# EAGLE design CurrentProbe (EAGLE 9.6.2)
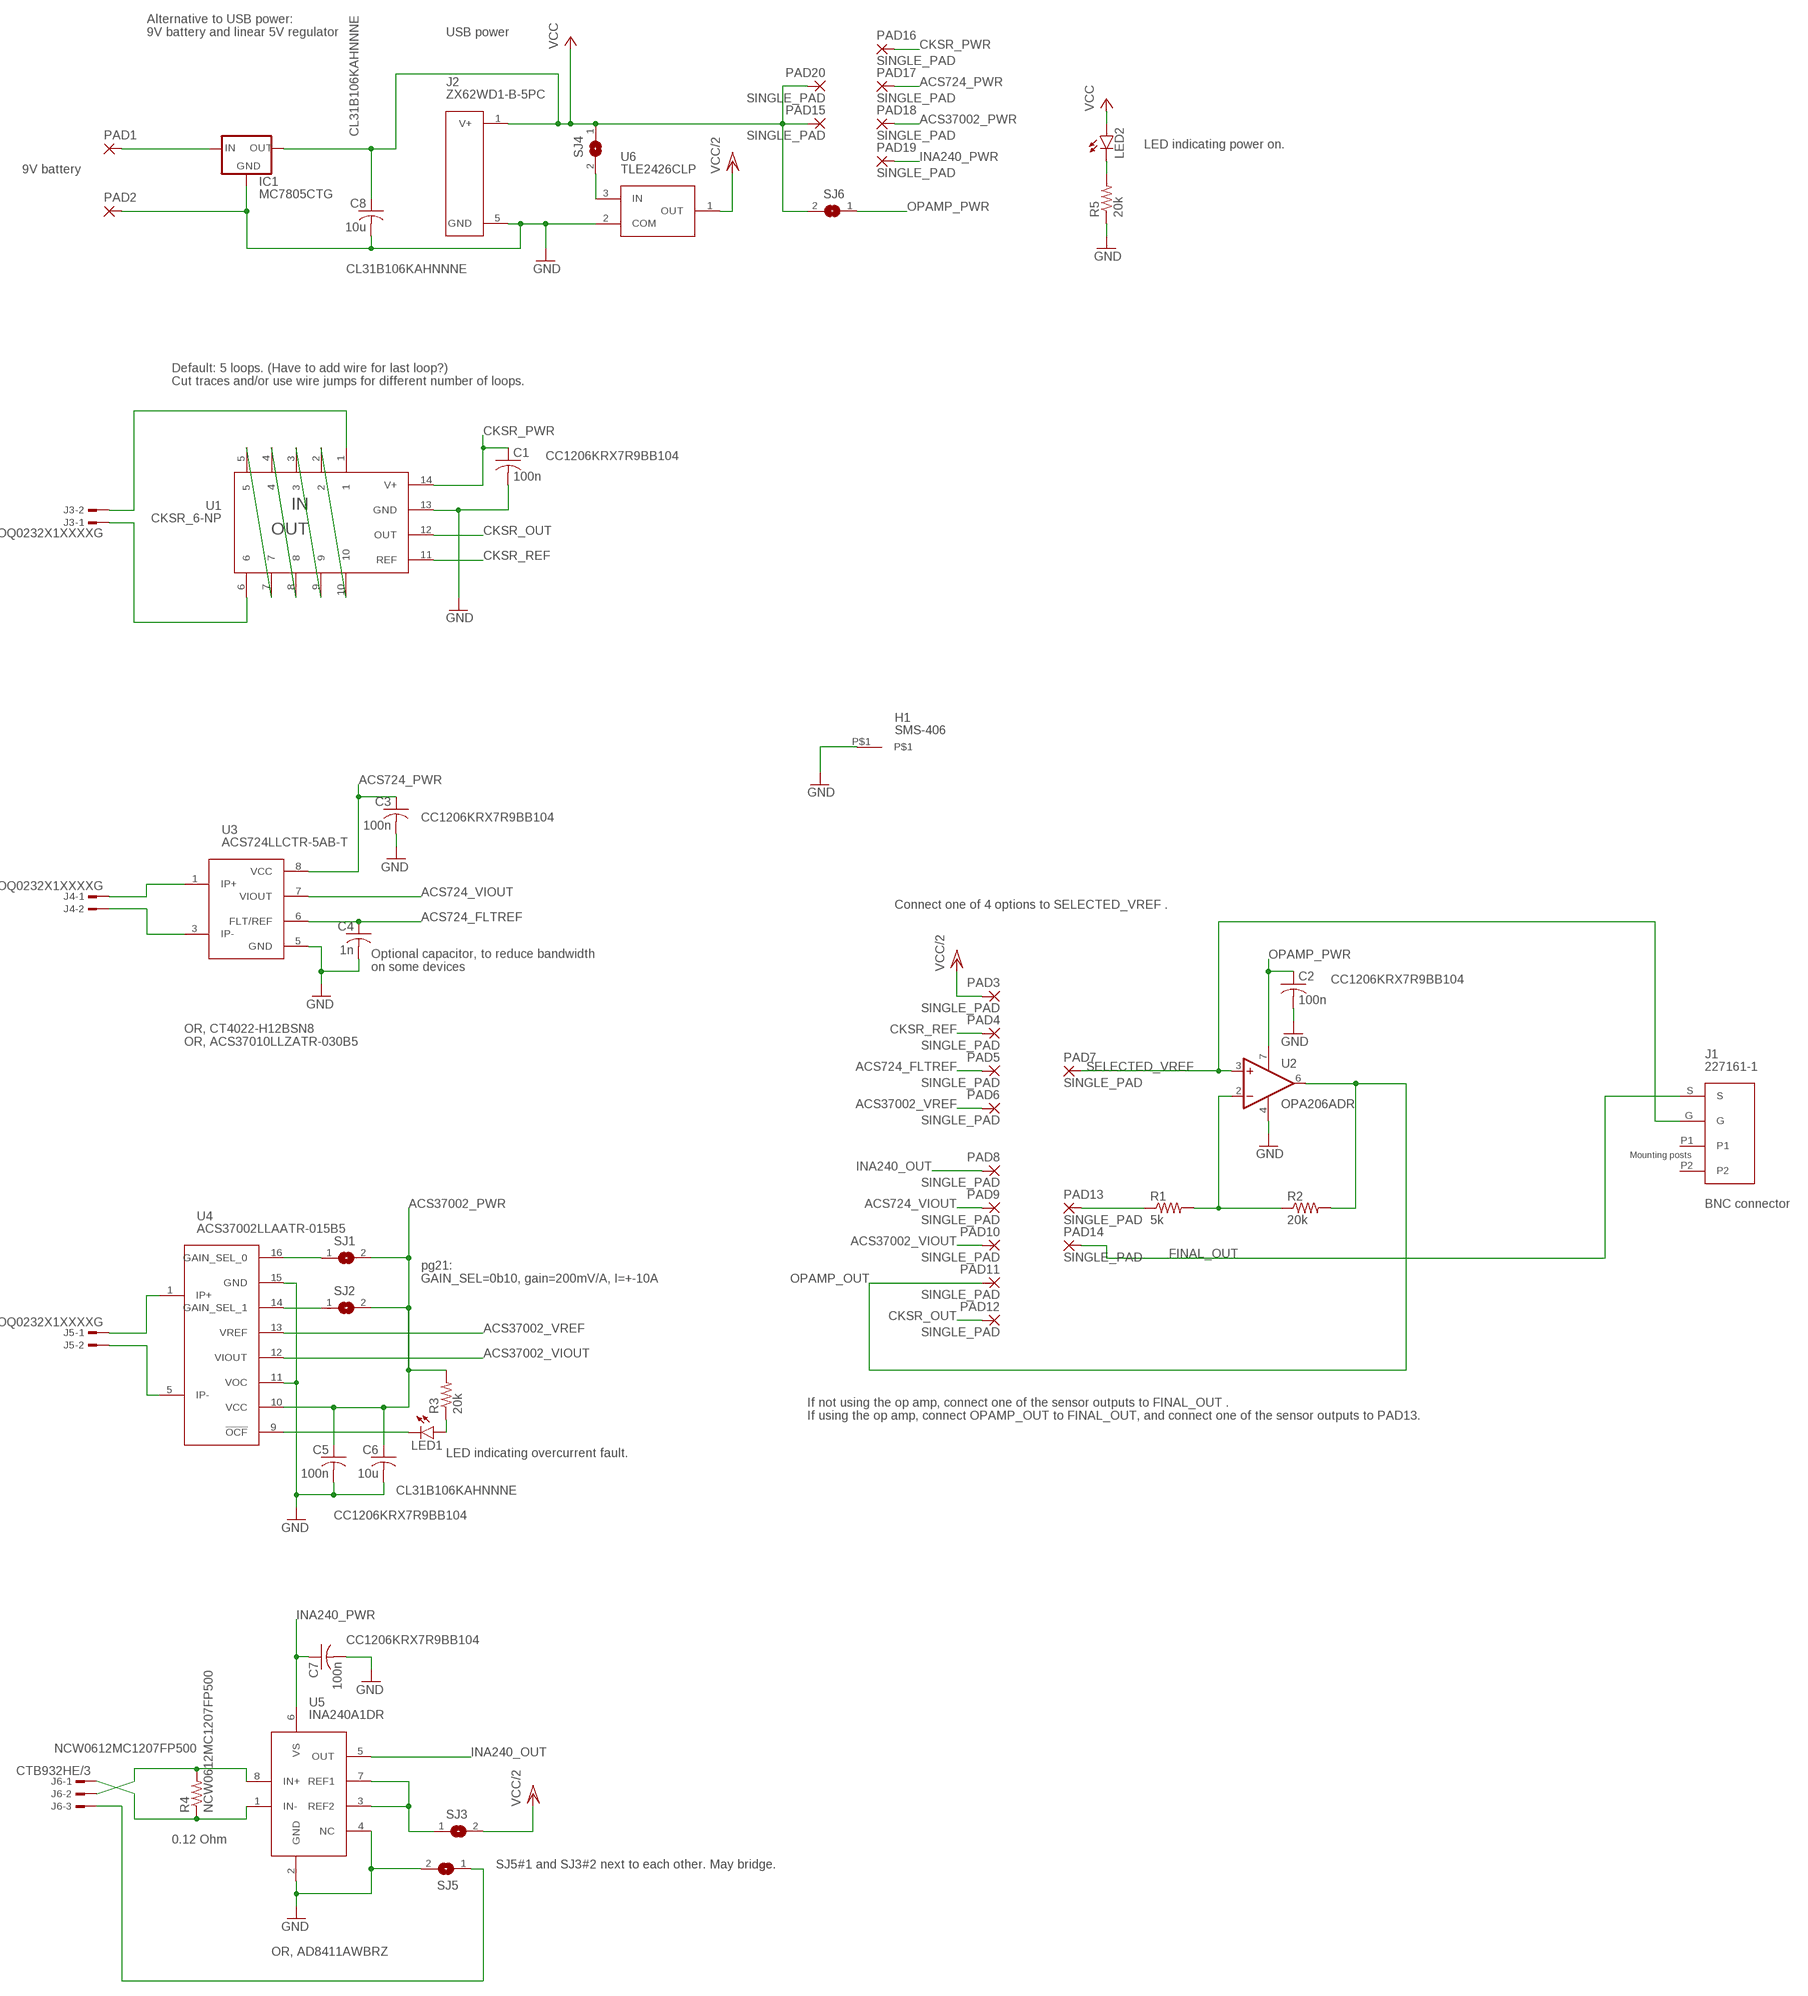
[diagram p0: schematic, sheet 1]

## Parts
C1  100n  C-USC1206K  [C1206K]
C2  100n  C-USC1206K  [C1206K]
C3  100n  C-USC1206K  [C1206K]
C4  1n  C-USC1206K  [C1206K]
C5  100n  C-USC1206K  [C1206K]
C6  10u  C-USC1206K  [C1206K]
C7  100n  C-USC1206K  [C1206K]
C8  10u  C-USC1206K  [C1206K]
H1  SMS-406  [SMS-406]
IC1  MC7805CTG  78XXS  [78XXS]
J1  227161-1  [227161-1]
J2  ZX62WD1-B-5PC  [ZX62WD1-B-5PC]
J3  OQ0232X1XXXXG  [OQ0232X1XXXXG]
J4  OQ0232X1XXXXG  [OQ0232X1XXXXG]
J5  OQ0232X1XXXXG  [OQ0232X1XXXXG]
J6  CTB932HE/3  [CTB932HE/3]
LED1  LEDSQR2X5  [LED2X5]
LED2  LEDSQR2X5  [LED2X5]
PAD1  2,54/1,0  [2,54/1,0]
PAD2  2,54/1,0  [2,54/1,0]
PAD3  SINGLE_PAD  [CIRCLE_PAD]
PAD4  SINGLE_PAD  [CIRCLE_PAD]
PAD5  SINGLE_PAD  [CIRCLE_PAD]
PAD6  SINGLE_PAD  [CIRCLE_PAD]
PAD7  SINGLE_PAD  [CIRCLE_PAD]
PAD8  SINGLE_PAD  [CIRCLE_PAD]
PAD9  SINGLE_PAD  [CIRCLE_PAD]
PAD10  SINGLE_PAD  [CIRCLE_PAD]
PAD11  SINGLE_PAD  [CIRCLE_PAD]
PAD12  SINGLE_PAD  [CIRCLE_PAD]
PAD13  SINGLE_PAD  [CIRCLE_PAD]
PAD14  SINGLE_PAD  [CIRCLE_PAD]
PAD15  SINGLE_PAD  [CIRCLE_PAD]
PAD16  SINGLE_PAD  [CIRCLE_PAD]
PAD17  SINGLE_PAD  [CIRCLE_PAD]
PAD18  SINGLE_PAD  [CIRCLE_PAD]
PAD19  SINGLE_PAD  [CIRCLE_PAD]
PAD20  SINGLE_PAD  [CIRCLE_PAD]
R1  5k  R-US_R1206  [R1206]
R2  20k  R-US_R1206  [R1206]
R3  20k  R-US_0207/12  [0207/12]
R4  NCW0612MC1207FP500  [R0612]
R5  20k  R-US_0207/7  [0207/7]
SJ1  SJ  [SJ]
SJ2  SJ  [SJ]
SJ3  SJ  [SJ]
SJ4  SJ  [SJ]
SJ5  SJ  [SJ]
SJ6  SJ  [SJ]
U1  CKSR_6-NP  [CKSR_XX-NP]
U2  OPA206ADR  [D0008A]
U3  ACS724LLCTR-5AB-T  [ALLEGRO_SOIC8]
U4  ACS37002LLAATR-015B5  [ALLEGRO_SOIC16]
U5  INA240A1DR  [D0008A]
U6  TLE2426CLP  [LP0003A]

## Nets
ACS724_FLTREF: C4.1 PAD5.1(P) U3.6(FLT/REF)
ACS724_PWR: C3.1 PAD17.1(P) U3.8(VCC)
ACS724_VIOUT: PAD9.1(P) U3.7(VIOUT)
ACS37002_PWR: C5.1 C6.1 PAD18.1(P) R3.2 SJ1.2 SJ2.2 U4.10(VCC)
ACS37002_VIOUT: PAD10.1(P) U4.12(VIOUT)
ACS37002_VREF: PAD6.1(P) U4.13(VREF)
CKSR_OUT: PAD12.1(P) U1.12(OUT)
CKSR_PWR: C1.1 PAD16.1(P) U1.14(V+)
CKSR_REF: PAD4.1(P) U1.11(REF)
FINAL_OUT: J1.S PAD14.1(P)
GND: C1.2 C2.2 C3.2 C4.2 C5.2 C6.2 C7.2 C8.2 H1.P$1 IC1.GND J2.5(GND) PAD2.1(P) R5.1 SJ5.2 U1.13(GND) U2.4(V-) U3.5(GND) U4.11(VOC) U4.15(GND) U5.2(GND) U5.4(NC) U6.2(COM)
INA240_OUT: PAD8.1(P) U5.5(OUT)
INA240_PWR: C7.1 PAD19.1(P) U5.6(VS)
N$1: J3.2 U1.1
N$2: J3.1 U1.6
N$3: U1.2 U1.10
N$4: U1.3 U1.9
N$5: U1.4 U1.8
N$6: U1.5 U1.7
N$7: J4.1 U3.1(IP+)
N$8: IC1.IN PAD1.1(P)
N$9: PAD13.1(P) R1.1
N$10: R1.2 R2.1 U2.2(-IN)
N$11: J4.2 U3.3(IP-)
N$12: J5.1 U4.1(IP+)
N$13: J5.2 U4.5(IP-)
N$14: J6.2 R4.2 U5.8(IN+)
N$15: SJ2.1 U4.14(GAIN_SEL_1)
N$16: SJ1.1 U4.16(GAIN_SEL_0)
N$17: J6.1 R4.1 U5.1(IN-)
N$18: LED1.A R3.1
N$19: LED1.K(C) U4.9(!OCF!)
N$20: SJ3.1 U5.3(REF2) U5.7(REF1)
N$21: SJ4.2 U6.3(IN)
N$22: LED2.K(C) R5.2
N$23: J6.3 SJ5.1
OPAMP_OUT: PAD11.1(P) R2.2 U2.6(OUT)
OPAMP_PWR: C2.1 SJ6.1 U2.7(V+)
SELECTED_VREF: J1.G PAD7.1(P) U2.3(+IN)
VCC: C8.1 IC1.OUT J2.1(V+) LED2.A PAD15.1(P) PAD20.1(P) SJ4.1 SJ6.2
VCC/2: PAD3.1(P) SJ3.2 U6.1(OUT)
Unconnected: J1.P1 J1.P2

## Notes on the sheet
- Alternative to USB power:
  9V battery and linear 5V regulator
- USB power
- CL31B106KAHNNNE
- LED indicating power on.
- 9V battery
- CL31B106KAHNNNE
- Default: 5 loops. (Have to add wire for last loop?)
  Cut traces and/or use wire jumps for different number of loops.
- CC1206KRX7R9BB104
- CC1206KRX7R9BB104
- Connect one of 4 options to SELECTED_VREF .
- Optional capacitor, to reduce bandwidth
  on some devices
- CC1206KRX7R9BB104
- OR, CT4022-H12BSN8
  OR, ACS37010LLZATR-030B5
- BNC connector
- pg21:
  GAIN_SEL=0b10, gain=200mV/A, I=+-10A
- If not using the op amp, connect one of the sensor outputs to FINAL_OUT .
  If using the op amp, connect OPAMP_OUT to FINAL_OUT, and connect one of the sensor outputs to PAD13.
- LED indicating overcurrent fault.
- CL31B106KAHNNNE
- CC1206KRX7R9BB104
- CC1206KRX7R9BB104
- NCW0612MC1207FP500
- 0.12 Ohm
- SJ5#1 and SJ3#2 next to each other. May bridge.
- OR, AD8411AWBRZ

## Library data of the parts
C1-C8 = rcl:C-US: CAPACITOR, American symbol; SPICEPREFIX: C
H1 = CurrentProbe:SMS-406: LeaderTech SMS-406 metal shield.
IC1 = v-reg:78XXS: VOLTAGE REGULATOR
J1 = CurrentProbe:227161-1: TE Connectivity 227161-1 BNC connector.
J2 = CurrentProbe:ZX62WD1-B-5PC: Hirose Electric ZX62WD1-B-5PC micro usb B connector.
J3-J5 = CurrentProbe:OQ0232X1XXXXG: Anytek OQ0232x1xxxxG pluggable header.
J6 = CurrentProbe:CTB932HE/3: Camdenboss CTB932HE/3 pluggable header.
LED1 LED2 = led:LED: LED OSRAM: - CHIPLED LG R971, LG N971, LY N971, LG Q971, LY Q971, LO R971, LY R971 LH N974, LH R974 LS Q976, LO Q976, LY Q976 LO Q996 - Hyper CHIPLED LW Q18S LB Q993, LB Q99A, LB R99A - SideLED LS A670, LO A670, LY A670, LG A670, LP A670 LB A673, LV A673, LT A673, LW A673 LH A674 LY A675 LS A676, LA A676, LO A676, LY A676, LW A676 LS A679, LY A679, LG A679 - Hyper Micro SIDELED® LS Y876, LA Y876, LO Y876, LY Y876 LT Y87S - SmartLED LW L88C, LW L88S LB L89C, LB L89S, LG L890 LS L89K, LO L89K, LY L89K LS L896, LA L896, LO L896, LY L896 - TOPLED LS T670, LO T670, LY T670, LG T670, LP T670 LSG T670, LSP T670, LSY T670, LOP T670, LYG T670 LG T671, LOG T671, LSG T671 LB T673, LV T673, LT T673, LW T673 LH T674 LS T676, LA T676, LO T676, LY T676, LB T676, LH T676, LSB T676, LW T676 LB T67C, LV T67C, LT T67C, LS T67K, LO T67K, LY T67K, LW E67C LS E67B, LA E67B, LO E67B, LY E67B, LB E67C, LV E67C, LT E67C LW T67C LS T679, LY T679, LG T679 LS T770, LO T770, LY T770, LG T770, LP T770 LB T773, LV T773, LT T773, LW T773 LH T774 LS E675, LA E675, LY E675, LS T675 LS T776, LA T776, LO T776, LY T776, LB T776 LHGB T686 LT T68C, LB T68C - Hyper Mini TOPLED® LB M676 - Mini TOPLED Santana® LG M470 LS M47K, LO M47K, LY M47K Source: http://www.osram.convergy.de LUXEON: - LUMILED® LXK2-PW12-R00, LXK2-PW12-S00, LXK2-PW14-U00, LXK2-PW14-V00 LXK2-PM12-R00, LXK2-PM12-S00, LXK2-PM14-U00 LXK2-PE12-Q00, LXK2-PE12-R00, LXK2-PE12-S00, LXK2-PE14-T00, LXK2-PE14-U00 LXK2-PB12-K00, LXK2-PB12-L00, LXK2-PB12-M00, LXK2-PB14-N00, LXK2-PB14-P00, LXK2-PB14-Q00 LXK2-PR12-L00, LXK2-PR12-M00, LXK2-PR14-Q00, LXK2-PR14-R00 LXK2-PD12-Q00, LXK2-PD12-R00, LXK2-PD12-S00 LXK2-PH12-R00, LXK2-PH12-S00 LXK2-PL12-P00, LXK2-PL12-Q00, LXK2-PL12-R00 Source: www.luxeon.com KINGBRIGHT: KA-3528ASYC Source: www.kingbright.com
PAD1 PAD2 = wirepad:2,54/1,0: THROUGH-HOLE PAD
PAD3-PAD20 = CurrentProbe:SINGLE_PAD: Single pad.
R1-R3 R5 = rcl:R-US_: RESISTOR, American symbol; SPICEPREFIX: R
R4 = CurrentProbe:NCW?*: Vishay NCW 0406AT / 0612 AT resistors.; RESISTANCE: 0.12
SJ1-SJ6 = jumper:SJ: SMD solder JUMPER
U1 = CurrentProbe:CKSR_*-NP: LEM CKSR xx-NP current transducer. 2 extra pads for pins 1 and 10.
U2 = CurrentProbe:OPA206: Texas Instruments OPA206 op amp.
U3 = CurrentProbe:ACS724: Allegro ACS724 current sensor.; CURRENT: +-5A
U4 = CurrentProbe:ACS37002: Allegro ACS37002 current sensor.
U5 = CurrentProbe:INA240: Texas Instruments INA240 current sense amplifier.; GAIN: 20
U6 = CurrentProbe:TLE2426: Texas Instruments TLE2426CLP rail splitter, TO-92 package.; TEMP: 0-70

## Board
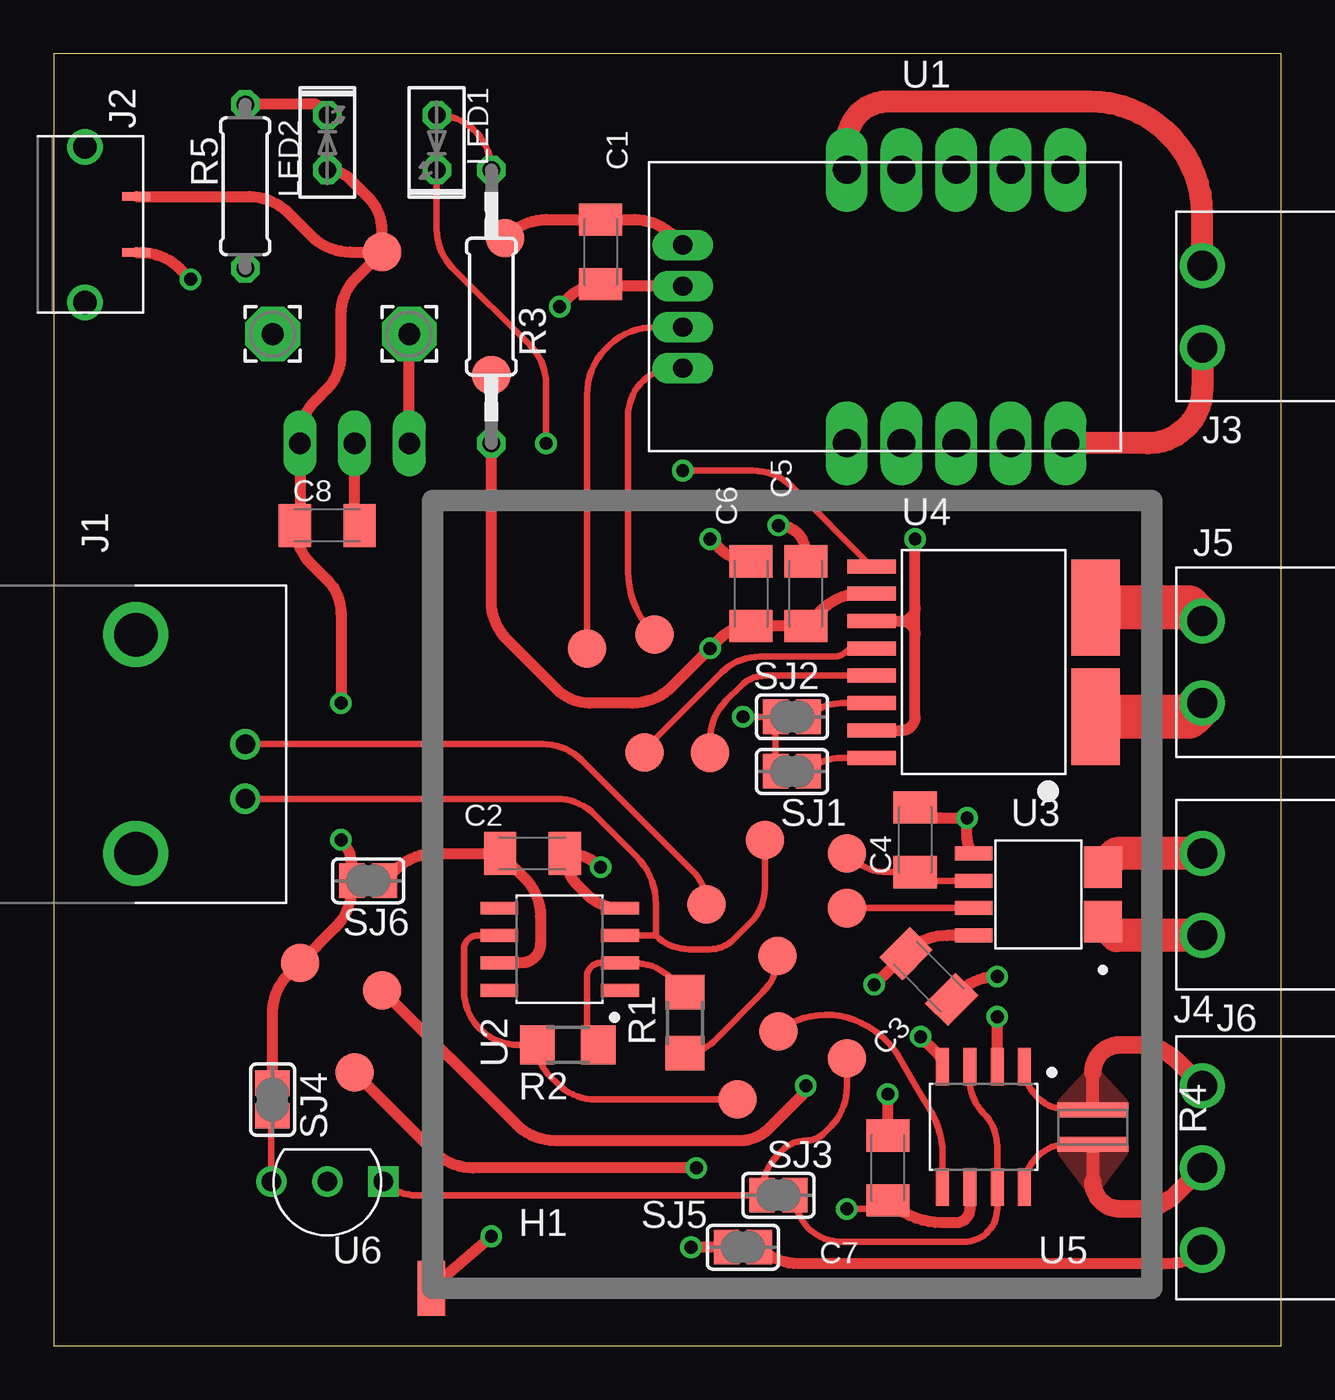
[diagram p1: board, top side]
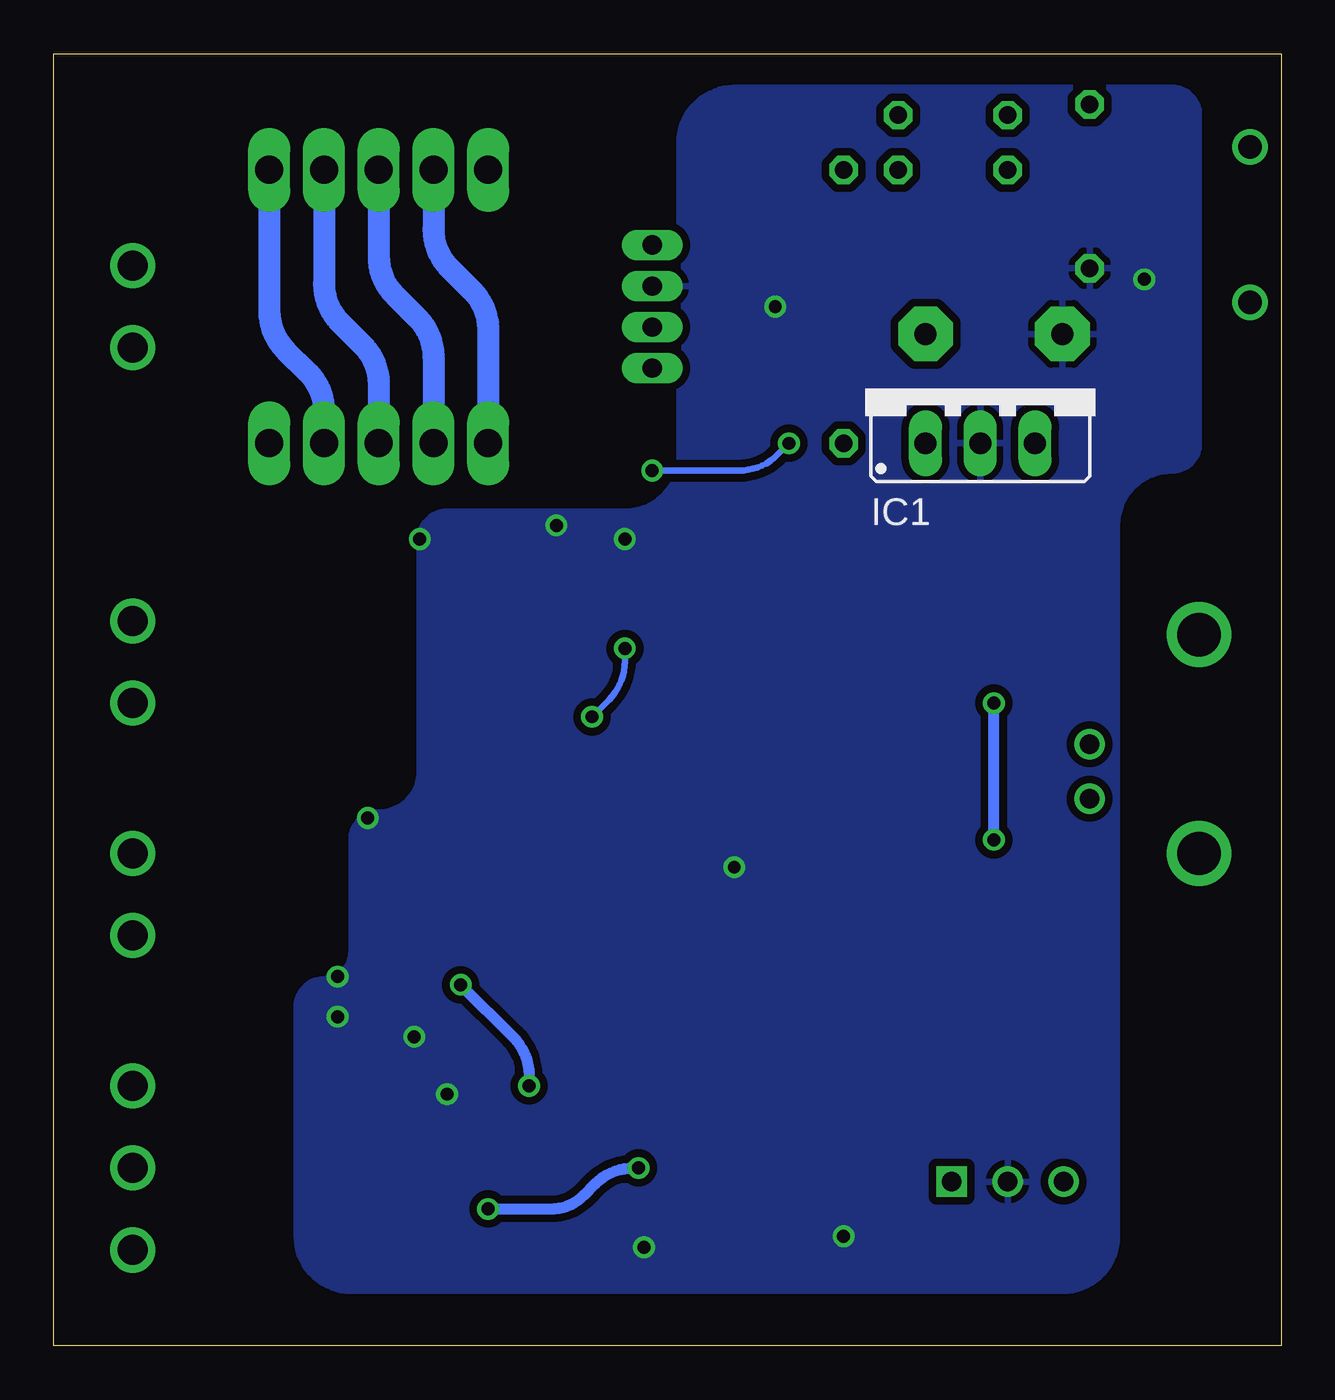
[diagram p2: board, bottom side, seen from below]

Size 57 x 60 mm. Coordinates in mm from the lower left corner, seen from the top.
Outline: 0,0 57,0 57,60 0,60 0,0
Copper layers (1*16): Top 0.07mm / dielectric 1.5mm / Bottom 0.07mm
Design rules "default *": minimum track width 12mil, minimum drill 0.6mm, track to track 14mil, track to pad 14mil, pad to pad 14mil, via to via 14mil, smd to smd 14mil, copper to edge 0.4mm, drill to drill 0.6mm, minimum pad ring 10mil, minimum via ring 8mil, stop-mask expansion 4mil, vias tented up to drill 0mil, thermal gap 12mil

### Footprints (pad centres in the part's own frame; a part is rotated, then mirrored left to right if it is on the bottom)
C1206K = smd 1.5 x 2: 1 -1.5,0; 2 1.5,0
SMS-406 = smd 2.54 x 1.27: P$1 -18.288,16.764
78XXS = drill 1.016 long: GND 0,-2.54; IN -2.54,-2.54; OUT 2.54,-2.54
227161-1 = drill 0.9: G -2.54,-5.08; S 0,-5.08 | drill 2.01: P1 5.08,0; P2 -5.08,0
ZX62WD1-B-5PC = smd 0.4 x 1.3: 1 -1.3,2.38; 5 1.3,2.38 | drill 1.1: P$6 3.61,0; P$7 -3.61,0
OQ0232X1XXXXG = drill 1.4: 1 1.905,0; 2 -1.905,0
CTB932HE/3 = drill 1.4: 1 -3.81,0; 2 0,0; 3 3.81,0
LED2X5 = drill 0.813 octagon: A -1.27,0; K 1.27,0
2,54/1,0 = drill 1.016 pad 2.54 octagon: 1 0,0
CIRCLE_PAD = smd 1.8 x 1.8: 1 0,0
R1206 = smd 1.6 x 1.803: 1 -1.422,0; 2 1.422,0
0207/12 = drill 0.813 octagon: 1 -6.35,0; 2 6.35,0
R0612 = smd 0.7 x 3.3: 1 -0.8,0; 2 0.8,0
0207/7 = drill 0.813 octagon: 1 -3.81,0; 2 3.81,0
SJ = smd 1.168 x 1.6: 1 -0.762,0; 2 0.762,0
CKSR_XX-NP = drill 1.3 pad 1.9 long: 1 -6.35,6.35; 2 -3.81,6.35; 3 -1.27,6.35; 4 1.27,6.35; 5 3.81,6.35; 6 3.81,-6.35; 7 1.27,-6.35; 8 -1.27,-6.35; 9 -3.81,-6.35; 10 -6.35,-6.35 | drill 0.9 pad 1.27 long: 11 -13.97,-2.857; 12 -13.97,-0.953; 13 -13.97,0.953; 14 -13.97,2.857
D0008A = smd 1.75 x 0.6: 1 -2.8,1.905; 2 -2.8,0.635; 3 -2.8,-0.635; 4 -2.8,-1.905; 5 2.8,-1.905; 6 2.8,-0.635; 7 2.8,0.635; 8 2.8,1.905
ALLEGRO_SOIC8 = smd 1.92 x 1.75: 1 -1.27,-3; 3 1.27,-3 | smd 0.65 x 1.75: 5 1.905,3; 6 0.635,3; 7 -0.635,3; 8 -1.905,3
ALLEGRO_SOIC16 = smd 4.46 x 2.25: 1 -2.54,-5.2; 5 2.54,-5.2 | smd 0.65 x 2.25: 9 4.445,5.2; 10 3.175,5.2; 11 1.905,5.2; 12 0.635,5.2; 13 -0.635,5.2; 14 -1.905,5.2; 15 -3.175,5.2; 16 -4.445,5.2
LP0003A = drill 0.9 square: 1 -2.6,0 | drill 0.9: 2 0,0; 3 2.6,0

### Placement (x,y rotation side)
C1  25.4,50.8 270 top
C2  22.23,22.86 0 top
C3  40.64,17.14 315 top
C4  40.01,23.5 90 top
C5  34.92,34.92 90 top
C6  32.38,34.92 90 top
C7  38.73,8.26 90 top
C8  12.7,38.1 0 top
H1  34.29,20.95 90 top
IC1  13.97,44.45 0 bottom
J1  3.81,27.94 90 top
J2  1.45,52.07 270 top
J3  53.34,48.26 270 top
J4  53.34,20.95 270 top
J5  53.34,31.75 270 top
J6  53.34,8.26 270 top
LED1  17.78,55.88 270 top
LED2  12.7,55.88 90 top
PAD1  16.51,46.99 0 top
PAD2  10.16,46.99 0 top
PAD3  36.83,13.34 0 top
PAD4  27.89,33.02 0 top
PAD5  36.83,22.86 0 top
PAD6  30.48,27.54 0 top
PAD7  33.02,23.5 0 top
PAD8  33.66,14.61 0 top
PAD9  36.83,20.32 0 top
PAD10  27.43,27.56 0 top
PAD11  31.75,11.43 0 top
PAD12  24.77,32.38 0 top
PAD13  33.62,18.1 0 top
PAD14  30.32,20.5 0 top
PAD15  11.43,17.78 0 top
PAD16  20.95,51.44 0 top
PAD17  15.24,16.51 0 top
PAD18  20.32,45.09 0 top
PAD19  13.97,12.7 0 top
PAD20  15.24,50.8 0 top
R1  29.32,15 90 top
R2  23.88,13.97 180 top
R3  20.32,48.26 270 top
R4  48.26,10.16 270 top
R5  8.89,53.85 90 top
SJ1  34.29,26.67 180 top
SJ2  34.29,29.21 180 top
SJ3  33.66,6.99 180 top
SJ4  10.16,11.43 270 top
SJ5  32,4.57 180 top
SJ6  14.61,21.59 180 top
U1  43.18,48.26 0 top
U2  23.5,18.41 180 top
U3  45.72,20.95 90 top
U4  43.18,31.75 90 top
U5  43.18,10.16 270 top
U6  12.7,7.62 180 top

### Tracks (layer width: path | path; a pad name or v marks a point on that pad's centre or on a via)
ACS724_FLTREF
  Top 0.305: U3.6 40.98,21.59 arc-45 C4.1 38.75,22 arc-45 36.95,22.74 PAD5.1
ACS724_PWR  (via drill 0.6)
  Top 0.508: U3.8 41.48,19.05 arc45 39.68,18.31 C3.1 v38.1,16.76 | v34.92,12.06 arc-45 34.74,11.63 33.15,10.03 arc-45 31.92,9.53 23.28,9.53 arc-45 21.48,10.27 PAD17.1
  Bottom 0.508: v38.1,16.76 35.67,14.33 arc45 34.92,12.54 v34.92,12.06
ACS724_VIOUT
  Top 0.305: U3.7 PAD9.1
ACS37002_PWR  (via drill 0.6)
  Top 0.305: SJ1.2 SJ2.2 v32,29.21
  Top 0.508: PAD18.1 R3.2 20.32,34.58 arc45 21.06,32.78 23.37,30.48 arc45 24.9,29.84 26.89,29.84 arc45 28.68,30.59 v30.48,32.38 30.91,32.81 arc-45 C6.1 C5.1 35.68,34.18 arc-45 37.48,34.92 U4.10
  Bottom 0.305: v32,29.21 31.22,29.99 arc-45 30.48,31.79 v30.48,32.38
ACS37002_VIOUT
  Top 0.305: U4.12 37.14,32.38 arc45 36.83,32.26 arc-45 36.22,32 32.8,32 arc45 31.01,31.26 27.52,27.78 arc45 PAD10.1
ACS37002_VREF
  Top 0.305: U4.13 33.02,31.11 arc45 31.94,30.67 31.22,29.95 arc45 30.48,28.16 PAD6.1
CKSR_OUT
  Top 0.305: U1.12 27.94,47.31 arc90 24.77,44.13 PAD12.1
CKSR_PWR
  Top 0.508: U1.14 28.77,51.56 arc45 26.98,52.3 C1.1 22.87,52.3 arc45 21.08,51.56 PAD16.1
CKSR_REF
  Top 0.305: PAD4.1 PAD4.1 arc-45 26.67,35.98 26.67,43.18 arc-90 28.89,45.4 U1.11
FINAL_OUT
  Top 0.305: PAD14.1 arc45 29.69,22.02 24.51,27.2 arc45 22.72,27.94 J1.S
GND  (via drill 0.6)
  Top 0.508: U5.2 v43.81,15.27 arc-90 v43.82,15.28 | 26.27,20.32 U2.4 arc-45 24.77,20.95 24.34,21.38 arc-45 C2.2 | C2.2 23.58,22.43 | U4.15 39.37,28.57 arc90 40.01,29.21 40.01,33.02 | 40.01,33.02 arc90 39.37,33.66 | U4.11 39.37,33.66 | 39.37,33.66 arc90 40.01,34.29 | 40.01,34.29 v40.01,37.47 | 40.01,33.02 40.01,34.29 | 41.77,16.01 C3.2 42.02,16.4 arc-45 v43.81,17.14 | C7.2 v38.73,11.68 | C2.2 23.87,22.86 arc-45 v25.4,22.23 | U5.4 arc45 41.01,13.6 v40.26,14.35 | C8.2 arc-45 13.97,38.66 IC1.GND | C5.2 34.92,36.83 arc90 v33.66,38.1 | U1.13 25.61,49.21 arc-45 C1.2 arc45 23.92,48.69 v23.5,48.26 | C4.2 arc45 41.17,24.51 v42.42,24.51 42.42,23.59 arc45 U3.5 | C6.2 arc-45 30.91,37.04 v30.48,37.47 | H1.P$1 v20.32,5.08 | J2.5 4.06,50.77 arc-45 5.85,50.03 v6.35,49.53 | SJ5.2 v29.59,4.57
  pour Bottom: 5.08,58.42 25.4,58.42 arc-90 27.94,55.88 27.94,41.27 arc90 30.48,38.73 38.73,38.73 arc-90 40.01,37.47 40.01,26.67 arc90 41.91,24.77 arc-90 43.18,23.5 43.18,18.29 arc90 44.45,17.02 arc-90 45.72,15.75 45.72,5.08 arc-90 43.18,2.54 10.16,2.54 arc-90 7.62,5.08 7.62,36.83 7.62,38.1 arc90 5.08,40.64 arc-90 3.81,41.91 3.81,57.15 arc-90
INA240_OUT
  Top 0.305: U5.5 41.27,8.89 arc33 40.64,11.05 arc-5 39.37,13.21 arc46 36.83,15.24 arc54 PAD8.1
INA240_PWR  (via drill 0.6)
  Top 0.305: v36.83,6.35 37.76,6.35 arc45 C7.1
  Top 0.508: U5.6 42.55,6.35 arc-90 41.91,5.71 41.25,5.71 arc-45 C7.1 | v29.84,8.26 19.47,8.26 arc-45 17.67,9 PAD19.1
  Bottom 0.508: v36.83,6.35 33.92,6.35 arc-45 32.38,6.99 31.86,7.51 arc45 30.06,8.26 v29.84,8.26
N$1
  Top 1.016: J3.2 53.34,52.55 arc90 48.11,57.78 38.73,57.78 arc90 36.83,55.88 U1.1
N$2
  Top 1.016: J3.1 53.34,44.45 arc-90 50.8,41.91 U1.6
N$3
  Bottom 1.016: U1.2 39.37,51.85 arc-45 38.63,50.06 37.57,49 arc45 36.83,47.21 U1.10
N$4
  Bottom 1.016: U1.3 41.91,50.58 arc-45 41.17,48.79 40.11,47.73 arc45 39.37,45.94 U1.9
N$5
  Bottom 1.016: U1.4 44.45,49.31 arc-45 43.71,47.52 42.65,46.46 arc45 41.91,44.67 U1.8
N$6
  Bottom 1.016: U1.5 46.99,48.04 arc-45 46.25,46.25 45.19,45.19 arc45 44.45,43.4 U1.7
N$7
  Top 1.524: J4.1 49.35,19.05 U3.1
N$8
  Top 0.508: IC1.IN PAD1.1
N$9
  Top 0.305: PAD13.1 arc-45 32.92,16.41 30.63,14.12 arc-45 R1.1
N$10
  Top 0.305: R2.1 arc-90 24.77,14.5 24.77,17.14 arc-90 25.4,17.78 U2.2 26.91,17.78 arc-45 28.71,17.04 R1.2
N$11
  Top 1.524: J4.2 49.35,22.86 U3.3
N$12
  Top 2.032: J5.1 52.7,29.21 U4.1
N$13
  Top 2.032: J5.2 52.7,34.29 U4.5
N$14
  Top 0.305: R4.2 47.09,9.36 arc90 U5.8
  Top 0.61: R4.2 48.26,7.62
  Top 0.813: 48.26,7.62 arc90 49.53,6.35 50.38,6.35 arc45 52.18,7.09 J6.2
  pour Top (no thermals): 48.26,6.99 46.74,9.02 49.78,9.02
N$15
  Top 0.305: U4.14 36.59,29.84 arc45 SJ2.1
N$16
  Top 0.305: U4.16 36.59,27.3 arc45 SJ1.1
N$17
  Top 0.305: R4.1 47.09,10.96 arc-90 U5.1
  Top 0.61: R4.1 48.26,12.7
  Top 0.813: 48.26,12.7 arc-90 49.53,13.97 50.38,13.97 arc-45 52.18,13.23 J6.1
  pour Top (no thermals): 48.26,12.95 46.74,11.3 49.78,11.3
N$18
  Top 0.305: LED1.A arc-90 R3.1
N$19  (via drill 0.6)
  Top 0.305: U4.9 34.28,39.9 arc45 32.48,40.64 v29.21,40.64 | v22.86,41.91 22.86,44.67 arc45 22.12,46.46 18.52,50.06 arc-45 17.78,51.85 LED1.K
  Bottom 0.305: v29.21,40.64 25.18,40.64 arc-45 23.39,41.38 v22.86,41.91
N$20
  Top 0.305: U5.3 42.55,12.33 arc45 43.18,10.79 arc-45 43.81,9.26 U5.7 43.81,6.35 arc-90 42.29,4.83 36.58,4.83 arc-90 SJ3.1
N$21
  Top 0.305: U6.3 10.1,10.52 arc-45 SJ4.2
N$22
  Top 0.508: LED2.K 12.19,57.66 R5.2
N$23
  Top 0.508: J6.3 arc-45 51.81,3.81 34.58,3.81 arc-45 32.78,4.55 SJ5.1
OPAMP_OUT
  Top 0.305: U2.6 19.68,19.05 arc90 19.05,18.41 19.05,16.51 arc90 21.59,13.97 R2.2 arc45 23.07,12.49 23.39,12.17 arc45 25.18,11.43 PAD11.1
OPAMP_PWR
  Top 0.508: U2.7 21.72,17.78 arc90 22.61,18.67 22.61,19.94 arc45 21.87,21.71 C2.1 17.69,22.86 arc45 15.89,22.12 SJ6.1
SELECTED_VREF
  Top 0.305: U2.3 27.96,19.05 | PAD7.1 33.02,21.22 arc-45 32.38,19.68 31.56,18.86 arc-45 30.48,18.41 29.5,18.41 arc-45 27.96,19.05 | 27.96,19.05 27.96,20.52 arc45 27.04,22.75 25.13,24.66 arc45 23.33,25.4 J1.G
VCC  (via drill 0.6)
  Top 0.508: SJ4.1 10.16,15.46 arc-45 10.9,17.25 PAD15.1 13.1,19.45 arc45 13.84,21.25 SJ6.2 13.84,22.27 arc45 v13.34,23.5 | PAD20.1 14.08,49.64 arc45 13.34,47.84 13.34,45.98 arc-45 12.7,44.45 12.17,43.92 arc45 11.43,42.13 IC1.OUT 11.43,38.66 arc-45 C8.1 arc45 11.94,36.33 12.7,35.56 arc-45 13.34,34.03 v13.34,29.84 | PAD20.1 15.24,51.81 arc45 14.61,53.34 13.78,54.16 arc45 LED2.A | J2.1 9.08,53.37 arc-45 10.87,52.63 11.96,51.54 arc45 13.75,50.8 PAD20.1
  Bottom 0.508: v13.34,23.5 v13.34,29.84
VCC/2
  Top 0.305: PAD3.1 36.83,11.97 arc-45 36.09,10.18 35.79,9.88 arc-45 34.92,9.53 arc45 33.84,9.08 33.64,8.87 arc45 32.89,7.08 SJ3.2 16.83,6.99 arc-45 U6.1

### Text on the board
Document: Current Probe / / Current Sensor / Test Board V1